# EAGLE schematic rpi_stepper_motor_extention_board (EAGLE 9.2.2)

## Sheet 1 of 4
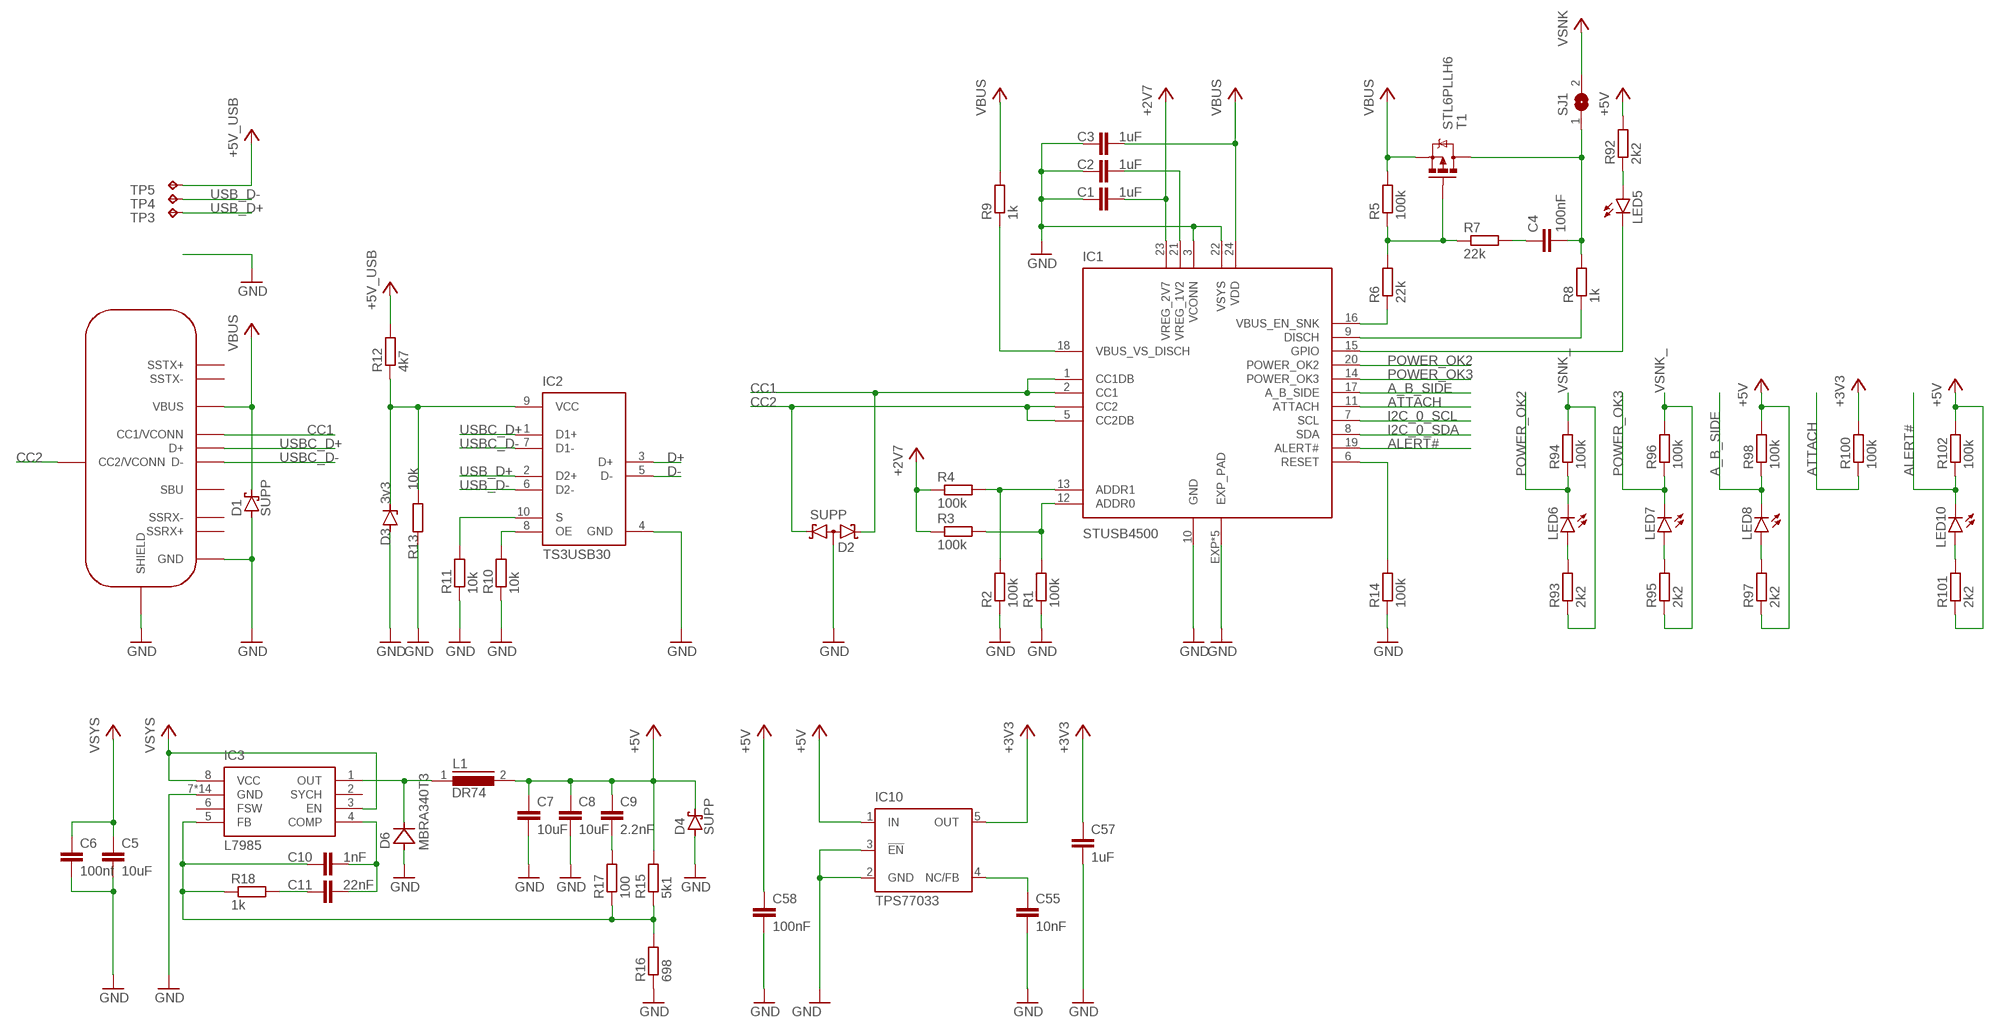
[diagram p0: schematic, sheet 1]

### Parts
C1  1uF  C-EUC0402K  [C0402K]
C2  1uF  C-EUC0402K  [C0402K]
C3  1uF  C-EUC0603  [C0603]
C4  100nF  C-EUC0402K  [C0402K]
C5  10uF  C-EUC1206K  [C1206K]
C6  100nf  C-EUC0402K  [C0402K]
C7  10uF  C-EUC1210  [C1210]
C8  10uF  C-EUC1210  [C1210]
C9  2.2nF  C-EUC0402K  [C0402K]
C10  1nF  C-EUC0402K  [C0402K]
C11  22nF  C-EUC0402K  [C0402K]
C55  10nF  C-EUC0402K  [C0402K]
C57  1uF  C-EUC0402K  [C0402K]
C58  100nF  C-EUC0402K  [C0402K]
CON1  USB-TYPE-CHYBRID  [USB-TYPE-C-HYBRID]
D1  SUPP  SMF5.0AT1  [SOD123FL]
D2  SUPP  BAT54A  [SOT23]
D3  3v3  ZENER-DIODESOD80C  [SOD80C]
D4  SUPP  SMF5.0AT1  [SOD123FL]
D6  MBRA340T3  [SMA]
IC1  STUSB4500  [QFN50P400X400X90-25T270]
IC2  TS3USB30  [QFN40P180X145X55-10]
IC3  L7985  [SOIC127P600X170-8]
IC10  TPS77033  [SOT23-DBV]
L1  DR74  [DR74]
LED5  LEDCHIPLED_0603  [CHIPLED_0603]
LED6  LEDCHIPLED_0603  [CHIPLED_0603]
LED7  LEDCHIPLED_0603  [CHIPLED_0603]
LED8  LEDCHIPLED_0603  [CHIPLED_0603]
LED10  LEDCHIPLED_0603  [CHIPLED_0603]
R1  100k  R-EU_R0402  [R0402]
R2  100k  R-EU_R0402  [R0402]
R3  100k  R-EU_R0402  [R0402]
R4  100k  R-EU_R0402  [R0402]
R5  100k  R-EU_R0402  [R0402]
R6  22k  R-EU_R0402  [R0402]
R7  22k  R-EU_R0402  [R0402]
R8  1k  R-EU_R0603  [R0603]
R9  1k  R-EU_R0603  [R0603]
R10  10k  R-EU_R0402  [R0402]
R11  10k  R-EU_R0402  [R0402]
R12  4k7  R-EU_R0402  [R0402]
R13  10k  R-EU_R0402  [R0402]
R14  100k  R-EU_R0402  [R0402]
R15  5k1  R-EU_R0805  [R0805]
R16  698  R-EU_R0805  [R0805]
R17  100  R-EU_R0402  [R0402]
R18  1k  R-EU_R0402  [R0402]
R92  2k2  R-EU_R0402  [R0402]
R93  2k2  R-EU_R0402  [R0402]
R94  100k  R-EU_R0402  [R0402]
R95  2k2  R-EU_R0402  [R0402]
R96  100k  R-EU_R0402  [R0402]
R97  2k2  R-EU_R0402  [R0402]
R98  100k  R-EU_R0402  [R0402]
R100  100k  R-EU_R0402  [R0402]
R101  2k2  R-EU_R0402  [R0402]
R102  100k  R-EU_R0402  [R0402]
SJ1  SJ  [SJ]
T1  STL6PLLH6  IRFHM9331  [POWERPAK1212-8]
TP3  TPB1,27  [B1,27]
TP4  TPB1,27  [B1,27]
TP5  TPB1,27  [B1,27]

### Nets
+2V7: C1.2 IC1.23(VREG_2V7) R3.1 R4.1
+3V3: C57.1 IC10.5(OUT) R100.2 ; also sheet 3
+5V: C7.1 C8.1 C9.1 C58.1 D4.C IC10.1(IN) L1.2 R15.2 R92.2 R97.1 R98.2 R101.1 R102.2 ; also sheet 3
+5V_USB: R12.2 TP5.TP
A_B_SIDE: IC1.17(A_B_SIDE) LED8.C R98.1
ALERT#: IC1.19(ALERT#) LED10.C R102.1
ATTACH: IC1.11(ATTACH) R100.1 ; also sheet 3
CC1 [CC_USBC]: CON1.5(CC1/VCONN) D2.2(K2) IC1.1(CC1DB) IC1.2(CC1)
CC2 [CC_USBC]: CON1.B5(CC2/VCONN) D2.1(K1) IC1.4(CC2) IC1.5(CC2DB)
D+: IC2.3(D+) ; also sheet 3
D-: IC2.5(D-) ; also sheet 3
GND: C1.1 C2.1 C3.1 C5.2 C6.2 C7.2 C8.2 C55.2 C57.2 C58.2 CON1.1(GND) CON1.12(GND) CON1.B1(GND) CON1.B12(GND) CON1.P$1(SHIELD) CON1.P$2(SHIELD) CON1.P$3(SHIELD) CON1.P$4(SHIELD) CON1.P$7(SHIELD) CON1.P$8(SHIELD) CON1.P$9(SHIELD) CON1.P$10(SHIELD) CON1.P$11(SHIELD) CON1.P$12(SHIELD) CON1.P$13(SHIELD) CON1.P$14(SHIELD) CON1.P$15(SHIELD) CON1.P$16(SHIELD) CON1.P$17(SHIELD) CON1.P$18(SHIELD) CON1.P$19(SHIELD) CON1.P$20(SHIELD) CON1.P$21(SHIELD) CON1.P$22(SHIELD) CON1.P$23(SHIELD) CON1.P$24(SHIELD) CON1.P$25(SHIELD) CON1.P$26(SHIELD) CON1.P$27(SHIELD) CON1.P$28(SHIELD) CON1.P$29(SHIELD) CON1.P$30(SHIELD) CON1.P$31(SHIELD) CON1.P$32(SHIELD) CON1.P$33(SHIELD) CON1.P$34(SHIELD) CON1.P$35(SHIELD) D1.A D2.3(AA) D3.A D4.A D6.A IC1.3(VCONN) IC1.10(GND) IC1.22(VSYS) IC1.EXP(EXP_PAD) IC1.P$1(EXP_PAD) IC1.P$2(EXP_PAD) IC1.P$3(EXP_PAD) IC1.P$4(EXP_PAD) IC2.4(GND) IC3.7(GND) IC3.EXP(GND) IC3.P$1(GND) IC3.P$2(GND) IC3.P$3(GND) IC3.P$4(GND) IC3.P$5(GND) IC3.P$6(GND) IC3.P$7(GND) IC3.P$8(GND) IC3.P$9(GND) IC3.P$10(GND) IC3.P$11(GND) IC3.P$12(GND) IC10.2(GND) IC10.3(!EN) R1.1 R2.1 R10.1 R11.1 R13.2 R14.1 R16.1 ; also sheet 2,3,4
I2C_0_SCL [I2C_0]: IC1.7(SCL) ; also sheet 3
I2C_0_SDA [I2C_0]: IC1.8(SDA) ; also sheet 3
N$1: IC1.12(ADDR0) R1.2 R3.2
N$2: IC1.13(ADDR1) R2.2 R4.2
N$3: C2.2 IC1.21(VREG_1V2)
N$4: C4.1 R7.2
N$5: IC1.16(VBUS_EN_SNK) R6.1
N$6: R5.1 R6.2 R7.1 T1.G
N$7: IC1.18(VBUS_VS_DISCH) R9.1
N$8: IC1.9(DISCH) R8.1
N$9: IC2.8(OE) R10.2
N$10: IC2.10(S) R11.2
N$11: D6.C IC3.1(OUT) L1.1
N$12: D3.C IC2.9(VCC) R12.1 R13.1
N$13: IC1.6(RESET) R14.2
N$14: C10.1 IC3.5(FB) R15.1 R16.2 R17.1 R18.1
N$16: C9.2 R17.2
N$17: C10.2 C11.2 IC3.4(COMP)
N$18: C11.1 R18.2
N$124: C55.1 IC10.4(NC/FB)
N$125: LED5.A R92.1
N$127: LED6.A R93.2
N$128: LED10.A R101.2
N$129: LED7.A R95.2
N$130: IC1.15(GPIO) LED5.C
N$132: LED8.A R97.2
POWER_OK2: IC1.20(POWER_OK2) LED6.C R94.1
POWER_OK3: IC1.14(POWER_OK3) LED7.C R96.1
USB_D+: IC2.2(D2+) TP3.TP
USB_D-: IC2.6(D2-) TP4.TP
USBC_D+: CON1.6(D+) CON1.B6(D+) IC2.1(D1+)
USBC_D-: CON1.7(D-) CON1.B7(D-) IC2.7(D1-)
VBUS: C3.2 CON1.4(VBUS) CON1.9(VBUS) CON1.B4(VBUS) CON1.B9(VBUS) D1.C IC1.24(VDD) R5.2 R9.2 T1.S1(S) T1.S2(S) T1.S3(S)
VSNK: SJ1.2 ; also sheet 2
VSNK_: C4.2 R8.2 R93.1 R94.2 R95.1 R96.2 SJ1.1 T1.D1(D) T1.D2(D) T1.D3(D) T1.D4(D) T1.DPAD(D)
VSYS: C5.1 C6.1 IC3.3(EN) IC3.8(VCC) ; also sheet 2,4
Unconnected: CON1.2(SSTX+) CON1.3(SSTX-) CON1.8(SBU) CON1.10(SSRX-) CON1.11(SSRX+) CON1.B2(SSTX+) CON1.B3(SSTX-) CON1.B8(SBU) CON1.B10(SSRX-) CON1.B11(SSRX+) IC3.2(SYCH) IC3.6(FSW)

## Sheet 2 of 4
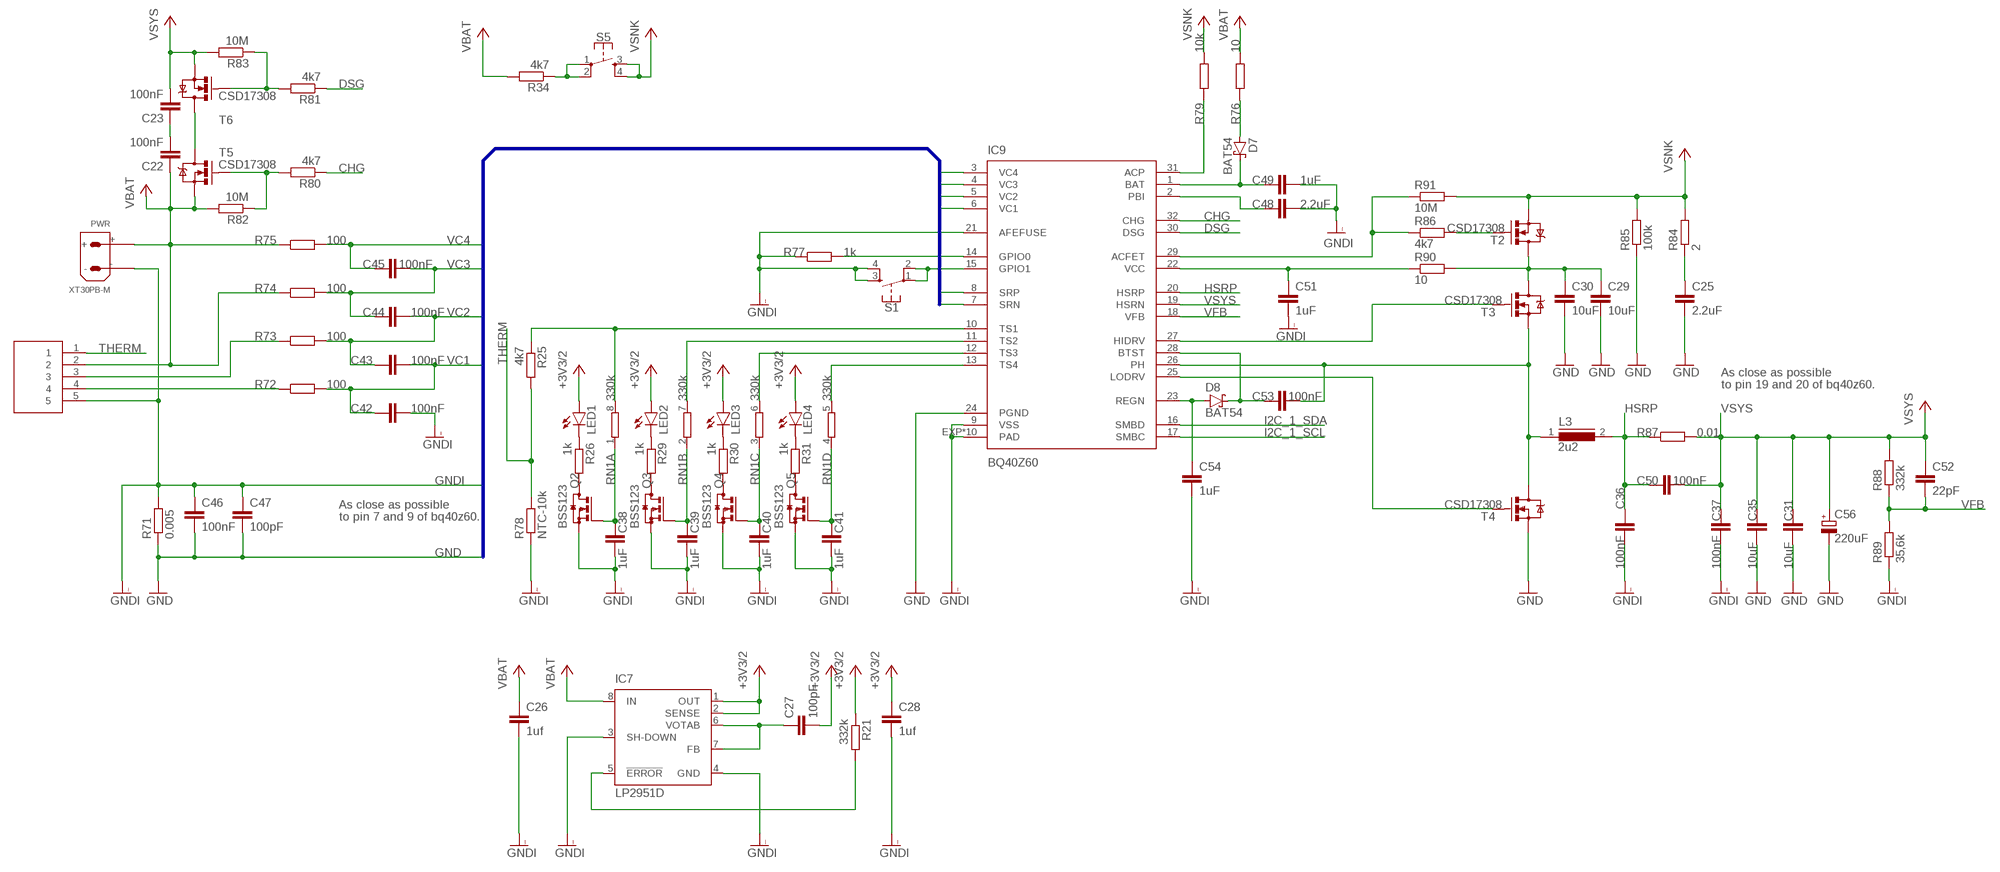
[diagram p1: schematic, sheet 2]

### Parts
C22  100nF  C-EUC0603K  [C0603K]
C23  100nF  C-EUC0603K  [C0603K]
C25  2.2uF  C-EUC0603K  [C0603K]
C26  1uf  C-EUC0402  [C0402]
C27  100pF  C-EUC0402  [C0402]
C28  1uf  C-EUC0402  [C0402]
C29  10uF  C-EUC1206K  [C1206K]
C30  10uF  C-EUC1206K  [C1206K]
C31  10uF  C-EUC1206K  [C1206K]
C35  10uF  C-EUC1206K  [C1206K]
C36  100nF  C-EUC0402K  [C0402K]
C37  100nF  C-EUC0402K  [C0402K]
C38  1uF  C-EUC0402K  [C0402K]
C39  1uF  C-EUC0402K  [C0402K]
C40  1uF  C-EUC0402K  [C0402K]
C41  1uF  C-EUC0402K  [C0402K]
C42  100nF  C-EUC0402K  [C0402K]
C43  100nF  C-EUC0402K  [C0402K]
C44  100nF  C-EUC0402K  [C0402K]
C45  100nF  C-EUC0402K  [C0402K]
C46  100nF  C-EUC0402  [C0402]
C47  100pF  C-EUC0402  [C0402]
C48  2.2uF  C-EUC0603K  [C0603K]
C49  1uF  C-EUC0603K  [C0603K]
C50  100nF  C-EUC0402K  [C0402K]
C51  1uF  C-EUC0603K  [C0603K]
C52  22pF  C-EUC0402K  [C0402K]
C53  100nF  C-EUC0402K  [C0402K]
C54  1uF  C-EUC0603K  [C0603K]
C56  220uF  CPOL-EU153CLV-0605  [153CLV-0605]
D7  BAT54  SMF5.0AT1  [SOD123FL]
D8  BAT54  SMF5.0AT1  [SOD123FL]
IC7  LP2951D  [SO08]
IC9  BQ40Z60  [QFN50P500X500X100-33T345]
L3  2u2  DR74  [DR74]
LED1  LEDCHIPLED_0603  [CHIPLED_0603]
LED2  LEDCHIPLED_0603  [CHIPLED_0603]
LED3  LEDCHIPLED_0603  [CHIPLED_0603]
LED4  LEDCHIPLED_0603  [CHIPLED_0603]
PWR  XT30PB-M  [XT30PB-M]
Q2  BSS123  [SOT23]
Q3  BSS123  [SOT23]
Q4  BSS123  [SOT23]
Q5  BSS123  [SOT23]
R21  332k  R-EU_R0402  [R0402]
R25  4k7  R-EU_R0402  [R0402]
R26  1k  R-EU_R0402  [R0402]
R29  1k  R-EU_R0402  [R0402]
R30  1k  R-EU_R0402  [R0402]
R31  1k  R-EU_R0402  [R0402]
R34  4k7  R-EU_R0402  [R0402]
R71  0.005  R-EU_R2010  [R2010]
R72  100  R-EU_R0603  [R0603]
R73  100  R-EU_R0603  [R0603]
R74  100  R-EU_R0603  [R0603]
R75  100  R-EU_R0603  [R0603]
R76  10  R-EU_R0402  [R0402]
R77  1k  R-EU_R0402  [R0402]
R78  NTC-10k  R-EU_R0603  [R0603]
R79  10k  R-EU_R0402  [R0402]
R80  4k7  R-EU_R0402  [R0402]
R81  4k7  R-EU_R0402  [R0402]
R82  10M  R-EU_R0402  [R0402]
R83  10M  R-EU_R0402  [R0402]
R84  2  R-EU_R0603  [R0603]
R85  100k  R-EU_R0402  [R0402]
R86  4k7  R-EU_R0402  [R0402]
R87  0.01  R-EU_R2512  [R2512]
R88  332k  R-EU_R0805  [R0805]
R89  35,6k  R-EU_R0805  [R0805]
R90  10  R-EU_R1206  [R1206]
R91  10M  R-EU_R0402  [R0402]
RN1  330k  4R-N0603-ARC  [0603-ARC]
S1  MOMENTARY-SWITCH-SPST-2-SMD-4.6X2.8MM  [TACTILE_SWITCH_SMD_4.6X2.8MM]
S5  MOMENTARY-SWITCH-SPST-2-SMD-4.6X2.8MM  [TACTILE_SWITCH_SMD_4.6X2.8MM]
T2  CSD17308  IRFH3707  [POWERPAK1212-8]
T3  CSD17308  IRFH3707  [POWERPAK1212-8]
T4  CSD17308  IRFH3707  [POWERPAK1212-8]
T5  CSD17308  IRFH3707  [POWERPAK1212-8]
T6  CSD17308  IRFH3707  [POWERPAK1212-8]
U$1  5PIN_CON_JOINT_TECH  [5PIN_CON_JOINT_TECH]

### Nets
+3V3/2: C27.2 C28.1 IC7.1(OUT) IC7.2(SENSE) LED1.A LED2.A LED3.A LED4.A R21.1
CHG: IC9.32(CHG) R80.1
DSG: IC9.30(DSG) R81.1
GND: C25.2 C29.2 C30.2 C31.2 C35.2 C46.2 C47.2 C56.- IC9.7(SRN) IC9.24(PGND) R71.1 R85.1 T4.S1(S) T4.S2(S) T4.S3(S) ; also sheet 1,3,4
GNDI: C26.2 C28.2 C36.2 C37.2 C38.2 C39.2 C40.2 C41.2 C42.1 C46.1 C47.1 C48.2 C49.2 C51.2 C54.2 IC7.3(SH-DOWN) IC7.4(GND) IC9.8(SRP) IC9.9(VSS) IC9.21(AFEFUSE) IC9.EXP(PAD) IC9.P$1(PAD) IC9.P$2(PAD) IC9.P$3(PAD) IC9.P$4(PAD) IC9.P$5(PAD) IC9.P$6(PAD) IC9.P$7(PAD) IC9.P$8(PAD) IC9.P$9(PAD) PWR.- Q2.2(S) Q3.2(S) Q4.2(S) Q5.2(S) R71.2 R77.1 R78.1 R89.1 S1.3 S1.4 U$1.5
HSRP: C36.1 C50.1 IC9.20(HSRP) L3.2 R87.1
I2C_1_SCL [I2C_1]: IC9.17(SMBC) ; also sheet 3
I2C_1_SDA [I2C_1]: IC9.16(SMBD) ; also sheet 3
N$56: LED1.C R26.1
N$57: LED2.C R29.1
N$58: LED3.C R30.1
N$59: LED4.C R31.1
N$60: C27.1 IC7.6(VOTAB) IC7.7(FB)
N$61: Q2.3(D) R26.2
N$62: Q3.3(D) R29.2
N$63: IC7.5(!ERROR) R21.2
N$64: Q5.3(D) R31.2
N$65: Q4.3(D) R30.2
N$66: R34.1 S5.1 S5.2
N$83: C38.1 Q2.1(G) RN1.1
N$84: C48.1 IC9.2(PBI)
N$86: IC9.10(TS1) R25.1 RN1.8
N$87: IC9.11(TS2) RN1.7
N$88: IC9.12(TS3) RN1.6
N$89: IC9.13(TS4) RN1.5
N$90: C39.1 Q3.1(G) RN1.2
N$91: D7.A R76.1
N$92: R72.1 U$1.4
N$93: C40.1 Q4.1(G) RN1.3
N$96: C41.1 Q5.1(G) RN1.4
N$97: C49.1 D7.C IC9.1(BAT)
N$99: R73.1 U$1.3
N$101: IC9.14(GPIO0) R77.2
N$102: IC9.15(GPIO1) S1.1 S1.2
N$103: IC9.31(ACP) R79.1
N$104: T5.D1(D) T5.D2(D) T5.D3(D) T5.D4(D) T5.DPAD(D) T6.D1(D) T6.D2(D) T6.D3(D) T6.D4(D) T6.DPAD(D)
N$105: R80.2 R82.1 T5.G
N$106: R81.2 R83.1 T6.G
N$107: C25.1 R84.1
N$108: C22.2 C23.1
N$109: C29.1 C30.1 R90.2 T2.D1(D) T2.D2(D) T2.D3(D) T2.D4(D) T2.DPAD(D) T3.D1(D) T3.D2(D) T3.D3(D) T3.D4(D) T3.DPAD(D)
N$110: C53.2 IC9.26(PH) L3.1 T3.S1(S) T3.S2(S) T3.S3(S) T4.D1(D) T4.D2(D) T4.D3(D) T4.D4(D) T4.DPAD(D)
N$111: R86.2 T2.G
N$112: IC9.27(HIDRV) T3.G
N$113: IC9.25(LODRV) T4.G
N$114: IC9.29(ACFET) R86.1 R91.1
N$115: C51.1 IC9.22(VCC) R90.1
N$116: C54.1 D8.A IC9.23(REGN)
N$117: C53.1 D8.C IC9.28(BTST)
THERM: R25.2 R78.2 U$1.1
VBAT: C22.1 C26.1 IC7.8(IN) PWR.+ R34.2 R74.1 R75.1 R76.2 R82.2 T5.S1(S) T5.S2(S) T5.S3(S) U$1.2
VC1: C42.2 C43.1 IC9.6(VC1) R72.2
VC2: C43.2 C44.1 IC9.5(VC2) R73.2
VC3: C44.2 C45.1 IC9.4(VC3) R74.2
VC4: C45.2 IC9.3(VC4) R75.2
VFB: C52.2 IC9.18(VFB) R88.1 R89.2
VSNK: R79.2 R84.2 R85.2 R91.2 S5.3 S5.4 T2.S1(S) T2.S2(S) T2.S3(S) ; also sheet 1
VSYS: C23.2 C31.1 C35.1 C37.1 C50.2 C52.1 C56.+ IC9.19(HSRN) R83.2 R87.2 R88.2 T6.S1(S) T6.S2(S) T6.S3(S) ; also sheet 1,4

### Buses
GND,GNDI,VC1,VC2,VC3,VC4

### Notes on the sheet
- As close as possible
- to pin 19 and 20 of bq40z60.
- As close as possible
- to pin 7 and 9 of bq40z60.

## Sheet 3 of 4
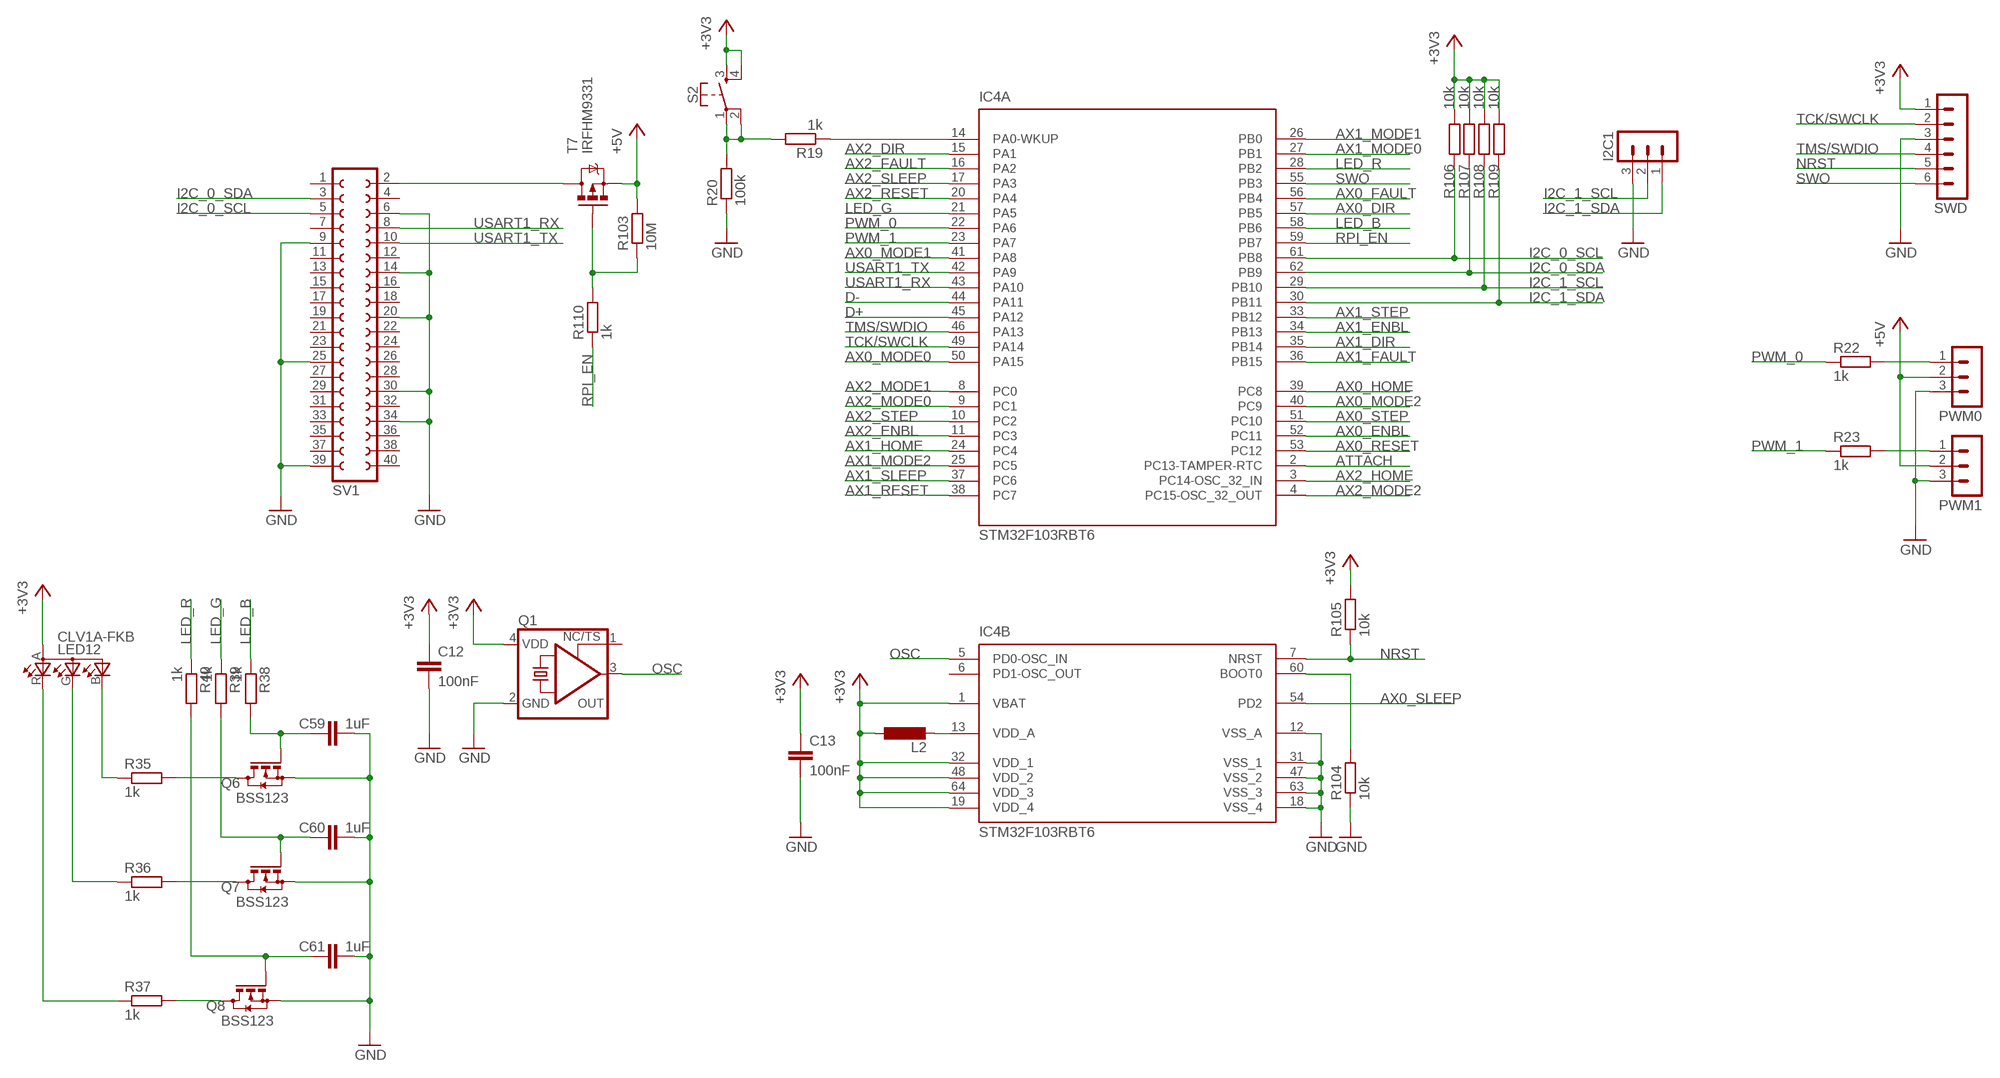
[diagram p2: schematic, sheet 3]

### Parts
C12  100nF  C-EUC0402K  [C0402K]
C13  100nF  C-EUC0402K  [C0402K]
C59  1uF  C-EUC0402K  [C0402K]
C60  1uF  C-EUC0402K  [C0402K]
C61  1uF  C-EUC0402K  [C0402K]
I2C1  MA03-1  [MA03-1]
IC4  STM32F103RBT6  [QFP50P1200X1200X160-64]
L2  L-EUL2012C  [L2012C]
LED12  CLV1A-FKB  [CLV1A-FKB]
PWM0  MA03-1  [MA03-1]
PWM1  MA03-1  [MA03-1]
Q1  KXO-PXO/XO-V95  [2.5X2.0_KXO-V95]
Q6  BSS123  [SOT23]
Q7  BSS123  [SOT23]
Q8  BSS123  [SOT23]
R19  1k  R-EU_R0402  [R0402]
R20  100k  R-EU_R0402  [R0402]
R22  1k  R-EU_R0402  [R0402]
R23  1k  R-EU_R0402  [R0402]
R35  1k  R-EU_R0402  [R0402]
R36  1k  R-EU_R0402  [R0402]
R37  1k  R-EU_R0402  [R0402]
R38  1k  R-EU_R0402  [R0402]
R39  1k  R-EU_R0402  [R0402]
R40  1k  R-EU_R0402  [R0402]
R103  10M  R-EU_R0402  [R0402]
R104  10k  R-EU_R0402  [R0402]
R105  10k  R-EU_R0402  [R0402]
R106  10k  R-EU_R0402  [R0402]
R107  10k  R-EU_R0402  [R0402]
R108  10k  R-EU_R0402  [R0402]
R109  10k  R-EU_R0402  [R0402]
R110  1k  R-EU_R0402  [R0402]
S2  MOMENTARY-SWITCH-SPST-2-SMD-4.6X2.8MM  [TACTILE_SWITCH_SMD_4.6X2.8MM]
SV1  FE20-2  [FE20-2]
SWD  MA06-1  [MA06-1]
T7  IRFHM9331  [POWERPAK1212-8]

### Nets
+3V3: C12.1 C13.1 IC4.1(B:VBAT) IC4.19(B:VDD_4) IC4.32(B:VDD_1) IC4.48(B:VDD_2) IC4.64(B:VDD_3) L2.1 LED12.A(ANODE) Q1.4(VDD) R105.2 R106.2 R107.2 R108.2 R109.2 S2.3 S2.4 SWD.1 ; also sheet 1
+5V: PWM0.2 PWM1.2 R103.2 T7.S1(S) T7.S2(S) T7.S3(S) ; also sheet 1
ATTACH: IC4.2(A:PC13-TAMPER-RTC) ; also sheet 1
AX0_DIR: IC4.57(A:PB5) ; also sheet 4
AX0_ENBL: IC4.52(A:PC11) ; also sheet 4
AX0_FAULT: IC4.56(A:PB4) ; also sheet 4
AX0_HOME: IC4.39(A:PC8) ; also sheet 4
AX0_MODE0: IC4.50(A:PA15) ; also sheet 4
AX0_MODE1: IC4.41(A:PA8) ; also sheet 4
AX0_MODE2: IC4.40(A:PC9) ; also sheet 4
AX0_RESET: IC4.53(A:PC12) ; also sheet 4
AX0_SLEEP: IC4.54(B:PD2) ; also sheet 4
AX0_STEP: IC4.51(A:PC10) ; also sheet 4
AX1_DIR: IC4.35(A:PB14) ; also sheet 4
AX1_ENBL: IC4.34(A:PB13) ; also sheet 4
AX1_FAULT: IC4.36(A:PB15) ; also sheet 4
AX1_HOME: IC4.24(A:PC4) ; also sheet 4
AX1_MODE0: IC4.27(A:PB1) ; also sheet 4
AX1_MODE1: IC4.26(A:PB0) ; also sheet 4
AX1_MODE2: IC4.25(A:PC5) ; also sheet 4
AX1_RESET: IC4.38(A:PC7) ; also sheet 4
AX1_SLEEP: IC4.37(A:PC6) ; also sheet 4
AX1_STEP: IC4.33(A:PB12) ; also sheet 4
AX2_DIR: IC4.15(A:PA1) ; also sheet 4
AX2_ENBL: IC4.11(A:PC3) ; also sheet 4
AX2_FAULT: IC4.16(A:PA2) ; also sheet 4
AX2_HOME: IC4.3(A:PC14-OSC_32_IN) ; also sheet 4
AX2_MODE0: IC4.9(A:PC1) ; also sheet 4
AX2_MODE1: IC4.8(A:PC0) ; also sheet 4
AX2_MODE2: IC4.4(A:PC15-OSC_32_OUT) ; also sheet 4
AX2_RESET: IC4.20(A:PA4) ; also sheet 4
AX2_SLEEP: IC4.17(A:PA3) ; also sheet 4
AX2_STEP: IC4.10(A:PC2) ; also sheet 4
D+: IC4.45(A:PA12) ; also sheet 1
D-: IC4.44(A:PA11) ; also sheet 1
GND: C12.2 C13.2 C59.2 C60.2 C61.2 I2C1.3 IC4.12(B:VSS_A) IC4.18(B:VSS_4) IC4.31(B:VSS_1) IC4.47(B:VSS_2) IC4.63(B:VSS_3) PWM0.3 PWM1.3 Q1.2(GND) Q6.2(S) Q7.2(S) Q8.2(S) R20.1 R104.1 SV1.6 SV1.9 SV1.14 SV1.20 SV1.25 SV1.30 SV1.34 SV1.39 SWD.3 ; also sheet 1,2,4
I2C_0_SCL [I2C_0]: IC4.61(A:PB8) R106.1 SV1.5 ; also sheet 1
I2C_0_SDA [I2C_0]: IC4.62(A:PB9) R107.1 SV1.3 ; also sheet 1
I2C_1_SCL [I2C_1]: I2C1.2 IC4.29(A:PB10) R108.1 ; also sheet 2
I2C_1_SDA [I2C_1]: I2C1.1 IC4.30(A:PB11) R109.1 ; also sheet 2
LED_B: IC4.58(A:PB6) R38.1
LED_G: IC4.21(A:PA5) R39.1
LED_R: IC4.28(A:PB2) R40.1
N$15: IC4.13(B:VDD_A) L2.2
N$54: LED12.G(CGREEN) R36.1
N$55: C59.1 Q6.1(G) R38.2
N$85: IC4.14(A:PA0-WKUP) R19.1
N$94: LED12.R(CRED) R37.1
N$95: LED12.B(CBLUE) R35.1
N$98: Q8.3(D) R37.2
N$100: Q7.3(D) R36.2
N$118: Q6.3(D) R35.2
N$120: C60.1 Q7.1(G) R39.2
N$121: C61.1 Q8.1(G) R40.2
N$131: SV1.2 T7.D1(D) T7.D2(D) T7.D3(D) T7.D4(D) T7.DPAD(D)
N$133: IC4.60(B:BOOT0) R104.2
N$134: R103.1 R110.2 T7.G
N$145: R19.2 R20.2 S2.1 S2.2
N$149: PWM0.1 R22.2
N$150: PWM1.1 R23.2
NRST: IC4.7(B:NRST) R105.1 SWD.5
OSC: IC4.5(B:PD0-OSC_IN) Q1.3(OUT)
PWM_0: IC4.22(A:PA6) R22.1
PWM_1: IC4.23(A:PA7) R23.1
RPI_EN: IC4.59(A:PB7) R110.1
SWO: IC4.55(A:PB3) SWD.6
TCK/SWCLK: IC4.49(A:PA14) SWD.2
TMS/SWDIO: IC4.46(A:PA13) SWD.4
USART1_RX [UART]: IC4.43(A:PA10) SV1.8
USART1_TX [UART]: IC4.42(A:PA9) SV1.10
Unconnected: IC4.6(B:PD1-OSC_OUT) Q1.1(TS) SV1.1 SV1.4 SV1.7 SV1.11 SV1.12 SV1.13 SV1.15 SV1.16 SV1.17 SV1.18 SV1.19 SV1.21 SV1.22 SV1.23 SV1.24 SV1.26 SV1.27 SV1.28 SV1.29 SV1.31 SV1.32 SV1.33 SV1.35 SV1.36 SV1.37 SV1.38 SV1.40

## Sheet 4 of 4
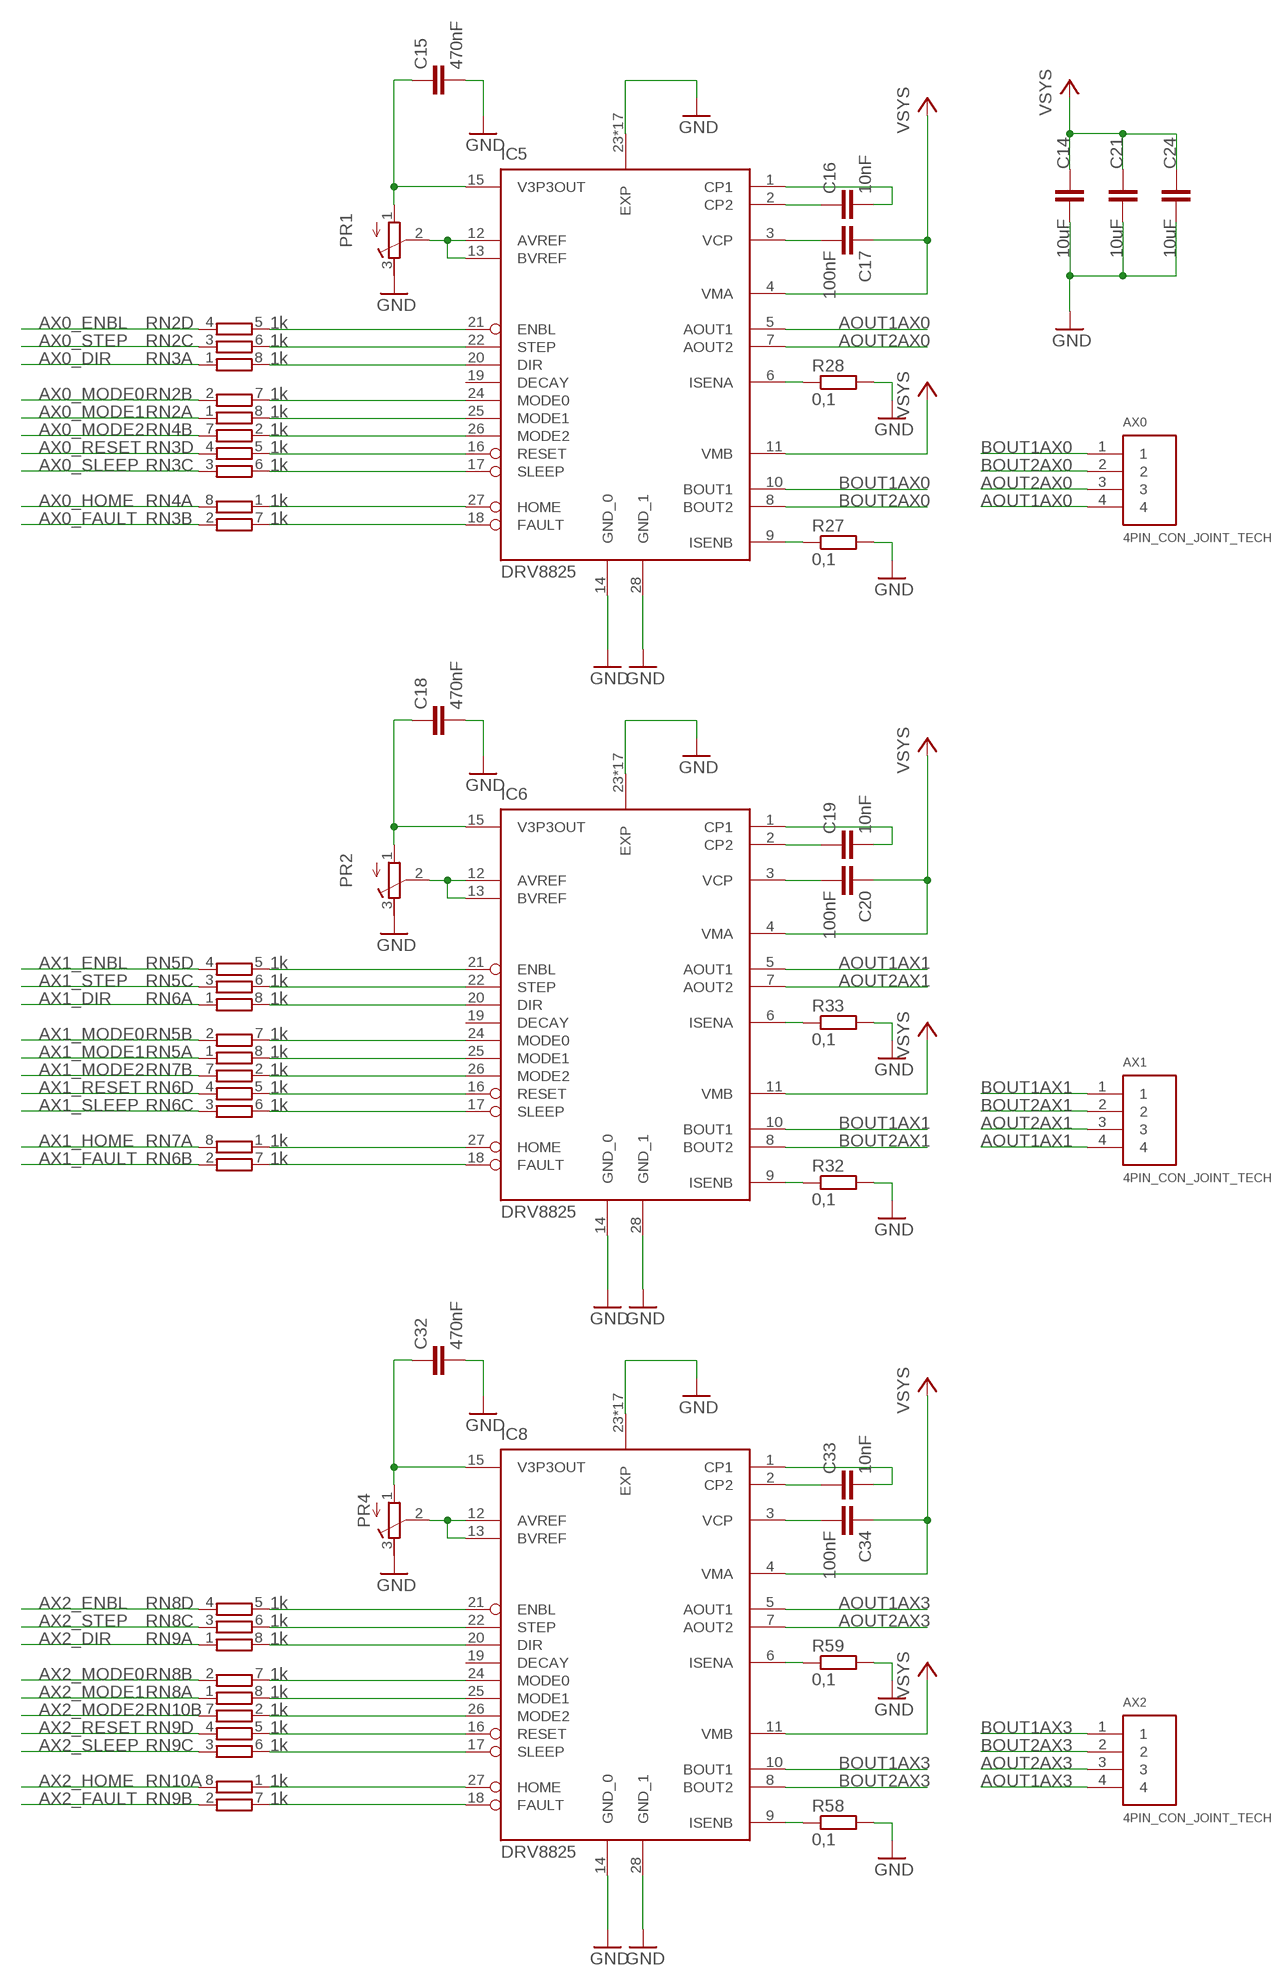
[diagram p3: schematic, sheet 4]

### Parts
AX0  4PIN_CON_JOINT_TECH  [4PIN_CON_JOINT_TECH]
AX1  4PIN_CON_JOINT_TECH  [4PIN_CON_JOINT_TECH]
AX2  4PIN_CON_JOINT_TECH  [4PIN_CON_JOINT_TECH]
C14  10uF  C-EUC1206K  [C1206K]
C15  470nF  C-EUC0402K  [C0402K]
C16  10nF  C-EUC0402K  [C0402K]
C17  100nF  C-EUC0402K  [C0402K]
C18  470nF  C-EUC0402K  [C0402K]
C19  10nF  C-EUC0402K  [C0402K]
C20  100nF  C-EUC0402K  [C0402K]
C21  10uF  C-EUC1206K  [C1206K]
C24  10uF  C-EUC1206K  [C1206K]
C32  470nF  C-EUC0402K  [C0402K]
C33  10nF  C-EUC0402K  [C0402K]
C34  100nF  C-EUC0402K  [C0402K]
IC5  DRV8825  [SOP65P640X120-28]
IC6  DRV8825  [SOP65P640X120-28]
IC8  DRV8825  [SOP65P640X120-28]
PR1  R-TRIMM3224J  [RTRIM3224J]
PR2  R-TRIMM3224J  [RTRIM3224J]
PR4  R-TRIMM3224J  [RTRIM3224J]
R27  0,1  R-EU_R0805  [R0805]
R28  0,1  R-EU_R0805  [R0805]
R32  0,1  R-EU_R0805  [R0805]
R33  0,1  R-EU_R0805  [R0805]
R58  0,1  R-EU_R0805  [R0805]
R59  0,1  R-EU_R0805  [R0805]
RN2  1k  4R-N0603-ARC  [0603-ARC]
RN3  1k  4R-N0603-ARC  [0603-ARC]
RN4  1k  4R-N0603-ARC  [0603-ARC]
RN5  1k  4R-N0603-ARC  [0603-ARC]
RN6  1k  4R-N0603-ARC  [0603-ARC]
RN7  1k  4R-N0603-ARC  [0603-ARC]
RN8  1k  4R-N0603-ARC  [0603-ARC]
RN9  1k  4R-N0603-ARC  [0603-ARC]
RN10  1k  4R-N0603-ARC  [0603-ARC]

### Nets
AOUT1AX0: AX0.4 IC5.5(AOUT1)
AOUT1AX1: AX1.4 IC6.5(AOUT1)
AOUT1AX3: AX2.4 IC8.5(AOUT1)
AOUT2AX0: AX0.3 IC5.7(AOUT2)
AOUT2AX1: AX1.3 IC6.7(AOUT2)
AOUT2AX3: AX2.3 IC8.7(AOUT2)
AX0_DIR: RN3.1 ; also sheet 3
AX0_ENBL: RN2.4 ; also sheet 3
AX0_FAULT: RN3.2 ; also sheet 3
AX0_HOME: RN4.8 ; also sheet 3
AX0_MODE0: RN2.2 ; also sheet 3
AX0_MODE1: RN2.1 ; also sheet 3
AX0_MODE2: RN4.7 ; also sheet 3
AX0_RESET: RN3.4 ; also sheet 3
AX0_SLEEP: RN3.3 ; also sheet 3
AX0_STEP: RN2.3 ; also sheet 3
AX1_DIR: RN6.1 ; also sheet 3
AX1_ENBL: RN5.4 ; also sheet 3
AX1_FAULT: RN6.2 ; also sheet 3
AX1_HOME: RN7.8 ; also sheet 3
AX1_MODE0: RN5.2 ; also sheet 3
AX1_MODE1: RN5.1 ; also sheet 3
AX1_MODE2: RN7.7 ; also sheet 3
AX1_RESET: RN6.4 ; also sheet 3
AX1_SLEEP: RN6.3 ; also sheet 3
AX1_STEP: RN5.3 ; also sheet 3
AX2_DIR: RN9.1 ; also sheet 3
AX2_ENBL: RN8.4 ; also sheet 3
AX2_FAULT: RN9.2 ; also sheet 3
AX2_HOME: RN10.8 ; also sheet 3
AX2_MODE0: RN8.2 ; also sheet 3
AX2_MODE1: RN8.1 ; also sheet 3
AX2_MODE2: RN10.7 ; also sheet 3
AX2_RESET: RN9.4 ; also sheet 3
AX2_SLEEP: RN9.3 ; also sheet 3
AX2_STEP: RN8.3 ; also sheet 3
BOUT1AX0: AX0.1 IC5.10(BOUT1)
BOUT1AX1: AX1.1 IC6.10(BOUT1)
BOUT1AX3: AX2.1 IC8.10(BOUT1)
BOUT2AX0: AX0.2 IC5.8(BOUT2)
BOUT2AX1: AX1.2 IC6.8(BOUT2)
BOUT2AX3: AX2.2 IC8.8(BOUT2)
GND: C14.2 C15.2 C18.2 C21.2 C24.2 C32.2 IC5.14(GND_0) IC5.23(EXP) IC5.28(GND_1) IC5.EXP IC5.P$1(EXP) IC5.P$2(EXP) IC5.P$3(EXP) IC5.P$4(EXP) IC5.P$5(EXP) IC5.P$6(EXP) IC5.P$7(EXP) IC5.P$8(EXP) IC5.P$9(EXP) IC5.P$10(EXP) IC5.P$11(EXP) IC5.P$12(EXP) IC5.P$13(EXP) IC5.P$14(EXP) IC5.P$15(EXP) IC6.14(GND_0) IC6.23(EXP) IC6.28(GND_1) IC6.EXP IC6.P$1(EXP) IC6.P$2(EXP) IC6.P$3(EXP) IC6.P$4(EXP) IC6.P$5(EXP) IC6.P$6(EXP) IC6.P$7(EXP) IC6.P$8(EXP) IC6.P$9(EXP) IC6.P$10(EXP) IC6.P$11(EXP) IC6.P$12(EXP) IC6.P$13(EXP) IC6.P$14(EXP) IC6.P$15(EXP) IC8.14(GND_0) IC8.23(EXP) IC8.28(GND_1) IC8.EXP IC8.P$1(EXP) IC8.P$2(EXP) IC8.P$3(EXP) IC8.P$4(EXP) IC8.P$5(EXP) IC8.P$6(EXP) IC8.P$7(EXP) IC8.P$8(EXP) IC8.P$9(EXP) IC8.P$10(EXP) IC8.P$11(EXP) IC8.P$12(EXP) IC8.P$13(EXP) IC8.P$14(EXP) IC8.P$15(EXP) PR1.3(E) PR2.3(E) PR4.3(E) R27.2 R28.2 R32.2 R33.2 R58.2 R59.2 ; also sheet 1,2,3
N$19: IC5.21(ENBL) RN2.5
N$20: IC5.22(STEP) RN2.6
N$21: IC5.20(DIR) RN3.8
N$22: IC5.16(RESET) RN3.5
N$23: IC5.18(FAULT) RN3.7
N$24: IC5.24(MODE0) RN2.7
N$25: IC5.12(AVREF) IC5.13(BVREF) PR1.2(S)
N$26: IC5.25(MODE1) RN2.8
N$27: C15.1 IC5.15(V3P3OUT) PR1.1(A)
N$28: IC5.17(SLEEP) RN3.6
N$29: C16.1 IC5.2(CP2)
N$30: C16.2 IC5.1(CP1)
N$31: IC5.9(ISENB) R27.1
N$32: IC5.6(ISENA) R28.1
N$33: C17.2 IC5.3(VCP)
N$34: IC5.26(MODE2) RN4.2
N$35: IC6.12(AVREF) IC6.13(BVREF) PR2.2(S)
N$36: C18.1 IC6.15(V3P3OUT) PR2.1(A)
N$37: IC6.17(SLEEP) RN6.6
N$38: C19.1 IC6.2(CP2)
N$39: C19.2 IC6.1(CP1)
N$40: IC6.9(ISENB) R32.1
N$41: IC6.6(ISENA) R33.1
N$42: C20.2 IC6.3(VCP)
N$43: IC6.21(ENBL) RN5.5
N$44: IC6.22(STEP) RN5.6
N$45: IC6.20(DIR) RN6.8
N$46: IC6.16(RESET) RN6.5
N$47: IC6.18(FAULT) RN6.7
N$48: IC6.24(MODE0) RN5.7
N$49: IC6.25(MODE1) RN5.8
N$50: IC6.26(MODE2) RN7.2
N$51: IC5.27(HOME) RN4.1
N$52: IC8.27(HOME) RN10.1
N$53: IC6.27(HOME) RN7.1
N$67: IC8.12(AVREF) IC8.13(BVREF) PR4.2(S)
N$68: C32.1 IC8.15(V3P3OUT) PR4.1(A)
N$69: IC8.17(SLEEP) RN9.6
N$70: C33.1 IC8.2(CP2)
N$71: C33.2 IC8.1(CP1)
N$72: IC8.9(ISENB) R58.1
N$73: IC8.6(ISENA) R59.1
N$74: C34.2 IC8.3(VCP)
N$75: IC8.21(ENBL) RN8.5
N$76: IC8.22(STEP) RN8.6
N$77: IC8.20(DIR) RN9.8
N$78: IC8.16(RESET) RN9.5
N$79: IC8.18(FAULT) RN9.7
N$80: IC8.24(MODE0) RN8.7
N$81: IC8.25(MODE1) RN8.8
N$82: IC8.26(MODE2) RN10.2
VSYS: C14.1 C17.1 C20.1 C21.1 C24.1 C34.1 IC5.4(VMA) IC5.11(VMB) IC6.4(VMA) IC6.11(VMB) IC8.4(VMA) IC8.11(VMB) ; also sheet 1,2
Unconnected: IC5.19(DECAY) IC6.19(DECAY) IC8.19(DECAY) RN4.3 RN4.4 RN4.5 RN4.6 RN7.3 RN7.4 RN7.5 RN7.6 RN10.3 RN10.4 RN10.5 RN10.6

## Library data of the parts
AX0 AX1 AX2 = JOINT_TECH_4PIN_CON:4PIN_CON_JOINT_TECH
C1-C55 C57-C61 = rcl:C-EU: CAPACITOR, European symbol; SPICEPREFIX: C
C56 = rcl:CPOL-EU: POLARIZED CAPACITOR, European symbol; SPICEPREFIX: C
CON1 = lio:USB-TYPE-C
D1 D4 D7 D8 = diode:SMF5.0AT1: 200 W Transient Voltage Suppressor Source: Data sheet <http://www.onsemi.com/pub_link/Collateral/SMF5.0AT1-D.PDF>
D2 = diode:BAT54A: Schottky Diodes Source: Fairchild .. BAT54.pdf
D3 = diode:ZENER-DIODE: Z-Diode
D6 = diode:MBRA340T3: Surface Mount Schottky Power Rectifier Source: http://www.onsemi.com/pub_link/Collateral/MBRA340T3-D.PDF
I2C1 PWM0 PWM1 = con-lstb:MA03-1: PIN HEADER; OC_FARNELL: unknown; OC_NEWARK: unknown
IC1 = STUSB4500:STUSB4500
IC2 = TS3USB30:TS3USB30
IC3 = L7985:L7985
IC4 = STM32F103:STM32F103RBT6
IC5 IC6 IC8 = DRV8825:DRV8825
IC7 = linear:LP2951: 100 mA, Low Power Low Dropout Voltage Regulator Source: http://www.onsemi.com/pub/Collateral/LP2950-D.PDF
IC9 = BQ40Z60:BQ40Z60
IC10 = texas:TPS770*: ULTRALOW-POWER 50-mA LOW-DROPOUT LINEAR REGULATORS 50-mA Low-Dropout Regulator Source: http://focus.ti.com/lit/ds/symlink/tps77001.pdf; MF: TEXAS INSTRUMENTS; MPN: TPS77033DBVT; OC_FARNELL: 8461570; OC_NEWARK: 77C1187
L1 L3 = inductors:DR74: High Power Density, High Efficiency, Shielded Inductors Source: coiltronics_dr_series.pdf; SPICEPREFIX: L
L2 = rcl:L-EU: INDUCTOR, European symbol; SPICEPREFIX: L
LED1-LED8 LED10 = led:LED: LED OSRAM: - CHIPLED LG R971, LG N971, LY N971, LG Q971, LY Q971, LO R971, LY R971 LH N974, LH R974 LS Q976, LO Q976, LY Q976 LO Q996 - Hyper CHIPLED LW Q18S LB Q993, LB Q99A, LB R99A - SideLED LS A670, LO A670, LY A670, LG A670, LP A670 LB A673, LV A673, LT A673, LW A673 LH A674 LY A675 LS A676, LA A676, LO A676, LY A676, LW A676 LS A679, LY A679, LG A679 - Hyper Micro SIDELED® LS Y876, LA Y876, LO Y876, LY Y876 LT Y87S - SmartLED LW L88C, LW L88S LB L89C, LB L89S, LG L890 LS L89K, LO L89K, LY L89K LS L896, LA L896, LO L896, LY L896 - TOPLED LS T670, LO T670, LY T670, LG T670, LP T670 LSG T670, LSP T670, LSY T670, LOP T670, LYG T670 LG T671, LOG T671, LSG T671 LB T673, LV T673, LT T673, LW T673 LH T674 LS T676, LA T676, LO T676, LY T676, LB T676, LH T676, LSB T676, LW T676 LB T67C, LV T67C, LT T67C, LS T67K, LO T67K, LY T67K, LW E67C LS E67B, LA E67B, LO E67B, LY E67B, LB E67C, LV E67C, LT E67C LW T67C LS T679, LY T679, LG T679 LS T770, LO T770, LY T770, LG T770, LP T770 LB T773, LV T773, LT T773, LW T773 LH T774 LS E675, LA E675, LY E675, LS T675 LS T776, LA T776, LO T776, LY T776, LB T776 LHGB T686 LT T68C, LB T68C - Hyper Mini TOPLED® LB M676 - Mini TOPLED Santana® LG M470 LS M47K, LO M47K, LY M47K Source: http://www.osram.convergy.de LUXEON: - LUMILED® LXK2-PW12-R00, LXK2-PW12-S00, LXK2-PW14-U00, LXK2-PW14-V00 LXK2-PM12-R00, LXK2-PM12-S00, LXK2-PM14-U00 LXK2-PE12-Q00, LXK2-PE12-R00, LXK2-PE12-S00, LXK2-PE14-T00, LXK2-PE14-U00 LXK2-PB12-K00, LXK2-PB12-L00, LXK2-PB12-M00, LXK2-PB14-N00, LXK2-PB14-P00, LXK2-PB14-Q00 LXK2-PR12-L00, LXK2-PR12-M00, LXK2-PR14-Q00, LXK2-PR14-R00 LXK2-PD12-Q00, LXK2-PD12-R00, LXK2-PD12-S00 LXK2-PH12-R00, LXK2-PH12-S00 LXK2-PL12-P00, LXK2-PL12-Q00, LXK2-PL12-R00 Source: www.luxeon.com KINGBRIGHT: KA-3528ASYC Source: www.kingbright.com
LED12 = _led-rgb:CLV1A-FKB: Chip LED RGB Source: http://document.sharpsma.com/files/GM1WA55311A_SS.pdf
PR1 PR2 PR4 = rcl:R-TRIMM: Trimm resistor
PWR = XT30:XT30PB-M
Q1 = crystal-geyer_V1_0:KXO-PXO/XO-V: Clock Oscillator (PXO/XO) MHz : KXO-V - Serie Model Size l/w/h [mm] Frequency Range Frequency Stability Temp. Range [°C] Output AECQ 200 availabel Datasheet KXO-V94 KXO-V94 KXO-V95 KXO-V95 KXO-V96 KXO-V96 KXO-V99 KXO-V99 KXO-97 KXO-V97 KXO-97 - KXO-V97 2.0/1.6/0.80 2.0/1.6/0.80 2.5/2.0/0.82 2.5/2.0/0.82 3.2/2.5/1.2 3.2/2.5/1.2 5.0/3.2/1.2 5.0/3.2/1.2 7.0/5.08/1.3 7.0/5.08/1.3 7.0/5.08/1.3 32,768 kHz 1,0 ~ 80,0 MHz 32,768 kHz 1,0 ~ 70,0 MHz 32,768 kHz 1,0 ~ 156,0 MHz 32,768 kHz 1,0 ~ 200,0 MHz 32,768 kHz 32,768 kHz 1,0 ~ 160,0 MHz ±25 … ±100ppm ±25 … ±100ppm ±25 … ±100ppm ±25 … ±100ppm ±25 … ±100ppm ±25 … ±100ppm ±25 … ±100ppm ±25 … ±100ppm ±25 … ±100ppm ±25 … ±100ppm ±25 … ±100ppm (*) -40°C …+85°C (*) -40°C …+85°C (*) -40°C …+85°C (*) -40°C …+85°C (*) -40°C …+85°C (*) -40°C …+85°C (*) -40°C …+85°C (*) -40°C …+85°C (*) -40°C …+85°C (*) -40°C …+85°C (*) -40°C …+85°C HCMOS HCMOS HCMOS HCMOS HCMOS HCMOS HCMOS HCMOS HCMOS HCMOS HCMOS - - yes yes yes yes - - - - - KXO-V94-kHz.pdf <http://www.geyer-electronic.de/uploads/tx_userartikelfrequenz/GEYER-KXO-V94-kHz.pdf> KXO-V94.pdf <http://www.geyer-electronic.de/uploads/tx_userartikelfrequenz/GEYER-KXO-V94.pdf> KXO-V95-kHz.pdf <http://www.geyer-electronic.de/uploads/tx_userartikelfrequenz/GEYER-KXO-V95-kHz.pdf> KXO-V95.pdf <http://www.geyer-electronic.de/uploads/tx_userartikelfrequenz/GEYER-KXO-V95.pdf> KXO-V96-kHz.pdf <http://www.geyer-electronic.de/uploads/tx_userartikelfrequenz/GEYER-KXO-V96-kHz.pdf> KXO-V96.pdf <http://www.geyer-electronic.de/uploads/tx_userartikelfrequenz/GEYER-KXO-V96.pdf> KXO-V99-kHz.pdf <http://www.geyer-electronic.de/uploads/tx_userartikelfrequenz/GEYER-KXO-V99-kHz.pdf> KXO-V99.pdf <http://www.geyer-electronic.de/uploads/tx_userartikelfrequenz/GEYER-KXO-V99.pdf> KXO-97-kHz.pdf <http://www.geyer-electronic.de/uploads/tx_userartikelfrequenz/GEYER-KXO-97-kHz.pdf> KXO-V97-kHz.pdf <http://www.geyer-electronic.de/uploads/tx_userartikelfrequenz/GEYER-KXO-V97-kHz.pdf> KXO-V97.pdf <http://www.geyer-electronic.de/uploads/tx_userartikelfrequenz/GEYER-KXO-V97.pdf> <http://www.geyer-electronic.de/fileadmin/template/img/logo-geyer-electronic.png> Details see: http://www.geyer-electronic.de/Frequenz-Produkte.9.0.html Created 2016-06-07, Hans Locher 2016 (C) Geyer Quartz Technology Hans Locher KXOV94,KXOV95;KXOV96;KXOV97;KXO97;2016;2520;3225;5032;70508;2,5x2,0;3,2x2,5;5,0x3,2;7,0x5,08;2.5x2.0;3.2x2.5;5.0x3.2;7.0x5.08;
Q2-Q8 = transistor-small-signal:BSS123: N-CHANNEL MOS FET
R1-R23 R25 R26 R29-R31 R34-R40 R71-R98 R100-R110 = rcl:R-EU_: RESISTOR, European symbol; SPICEPREFIX: R
R27 R28 R32 R33 R58 R59 = rcl:R-EU_: RESISTOR, European symbol
RN1-RN10 = resistor-dil:4R-N: Array Chip Resistor Source: RS Component / Phycomp; OC_FARNELL: unknown; OC_NEWARK: unknown
S1 S2 S5 = SparkFun-Switches:MOMENTARY-SWITCH-SPST-2: Momentary Switch (Pushbutton) - SPST - Two Circuits Normally-open (NO) SPST momentary switches (buttons, pushbuttons). Schematic symbol includes two switch circuits. Variants SMD-4.6MMX2.8MM - 4.60mm x 2.80mm Tactile Momentary Button Switch - Used on SparkFun SAMD21 Mini Breakout <https://www.sparkfun.com/products/13664> SMD-5.2MM - Mini Pushbutton Switch - SMD <https://www.sparkfun.com/products/8720> - Used on Arduino Pro Mini <https://www.sparkfun.com/products/11114>; PROD_ID: SWCH-13065
SJ1 = jumper:SJ: SMD solder JUMPER
SV1 = con-lsta:FE20-2: FEMALE HEADER; OC_FARNELL: unknown; OC_NEWARK: unknown
SWD = con-lstb:MA06-1: PIN HEADER; OC_FARNELL: unknown; OC_NEWARK: unknown; SPICEPREFIX: X
T1 T7 = Transistor_PQFN3x3:IRFHM9331
T2-T6 = Transistor_PQFN3x3:IRFH3707
TP3-TP5 = testpad:TP: Test pad
U$1 = JOINT_TECH_4PIN_CON:5PIN_CON_JOINT_TECH

## Net classes
0 default: width 0.254 mm, drill 0.2 mm, clearance 0.127 mm
1 CC_USBC: width 0.254 mm, drill 0.25 mm, clearance 0.127 mm
2 I2C_1: width 0.305 mm, drill 0.35 mm, clearance 0.127 mm
3 I2C_0: width 0.305 mm, drill 0.35 mm, clearance 0.127 mm
4 UART: width 0.305 mm, drill 0.35 mm, clearance 0.127 mm